# EAGLE schematic Server (EAGLE 7.3.0)
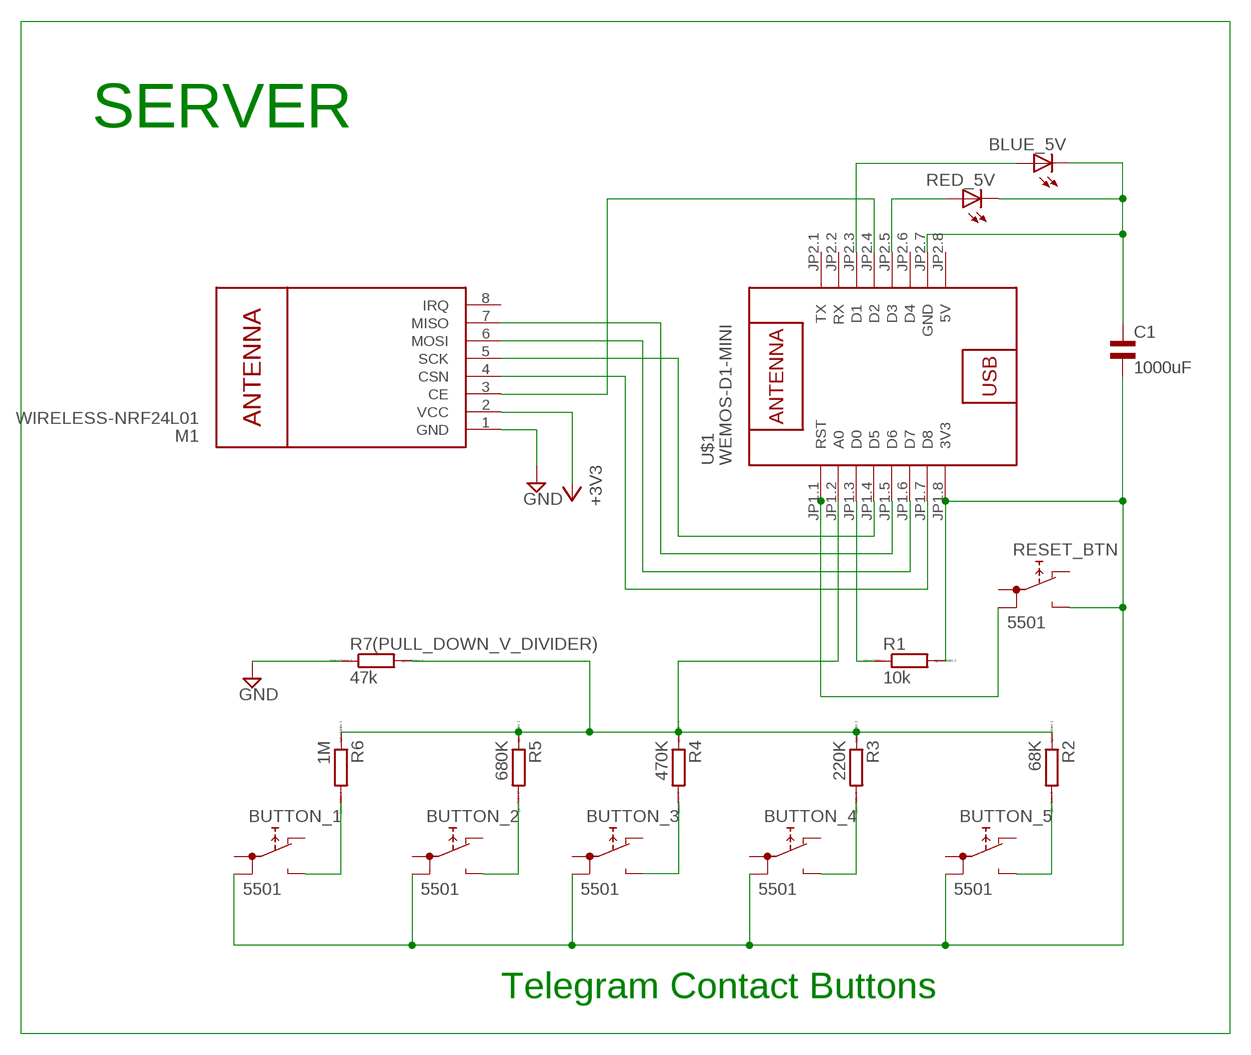
[diagram p0: schematic, sheet 1]

## Parts
BLUE_5V  LED5MM  [LED5MM]
BUTTON_1  5501  [5501]
BUTTON_2  5501  [5501]
BUTTON_3  5501  [5501]
BUTTON_4  5501  [5501]
BUTTON_5  5501  [5501]
C1  1000uF  EL-BI35-12AXIAL  [EU35-12]
M1  WIRELESS-NRF24L01  [WIRELESS-NRF24L01]
R1  10k  R0207/10  [0207/10]
R2  68K  R0207/10  [0207/10]
R3  220K  R0207/10  [0207/10]
R4  470K  R0207/10  [0207/10]
R5  680K  R0207/10  [0207/10]
R6  1M  R0207/10  [0207/10]
R7(PULL_DOWN_V_DIVIDER)  47k  R0207/10  [0207/10]
RED_5V  LED5MM  [LED5MM]
RESET_BTN  5501  [5501]
U$1  WEMOS-D1-MINI  [WEMOS-D1-MINI]

## Nets
+3V3: M1.2(VCC)
GND: M1.1(GND) R7(PULL_DOWN_V_DIVIDER).1
N$1: R2.1 R3.1 R4.1 R5.1 R6.1 R7(PULL_DOWN_V_DIVIDER).2 U$1.JP1.2(A0)
N$2: BUTTON_1.NO R6.2
N$3: BUTTON_2.NO R5.2
N$4: BUTTON_3.NO R4.2
N$5: BUTTON_4.NO R3.2
N$6: BUTTON_5.NO R2.2
N$7: M1.5(SCK) U$1.JP1.4(D5)
N$8: M1.7(MISO) U$1.JP1.5(D6)
N$9: R1.1 U$1.JP1.3(D0)
N$11: RESET_BTN.1B U$1.JP1.1(RST)
N$12: BUTTON_1.1B BUTTON_2.1B BUTTON_3.1B BUTTON_4.1B BUTTON_5.1B C1.2 R1.2 RESET_BTN.NO U$1.JP1.8(3V3)
N$13: M1.6(MOSI) U$1.JP1.6(D7)
N$14: M1.4(CSN) U$1.JP1.7(D8)
N$15: RED_5V.A U$1.JP2.5(D3)
N$16: BLUE_5V.A U$1.JP2.3(D1)
N$17: BLUE_5V.K(C) C1.1 RED_5V.K(C) U$1.JP2.7(GND)
N$18: M1.3(CE) U$1.JP2.4(D2)
Unconnected: BUTTON_1.1A BUTTON_1.NC BUTTON_2.1A BUTTON_2.NC BUTTON_3.1A BUTTON_3.NC BUTTON_4.1A BUTTON_4.NC BUTTON_5.1A BUTTON_5.NC M1.8(IRQ) RESET_BTN.1A RESET_BTN.NC U$1.JP2.1(TX) U$1.JP2.2(RX) U$1.JP2.6(D4)

## Notes on the sheet
- SERVER
- Telegram Contact Buttons

## Power pins joined to a net without a drawn wire
5V: U$1.JP2.8(5V)

## Library data of the parts
BLUE_5V RED_5V = led:LED: LED OSRAM: - CHIPLED LG R971, LG N971, LY N971, LG Q971, LY Q971, LO R971, LY R971 LH N974, LH R974 LS Q976, LO Q976, LY Q976 LO Q996 - Hyper CHIPLED LW Q18S LB Q993, LB Q99A, LB R99A - SideLED LS A670, LO A670, LY A670, LG A670, LP A670 LB A673, LV A673, LT A673, LW A673 LH A674 LY A675 LS A676, LA A676, LO A676, LY A676, LW A676 LS A679, LY A679, LG A679 - Hyper Micro SIDELED® LS Y876, LA Y876, LO Y876, LY Y876 LT Y87S - SmartLED LW L88C, LW L88S LB L89C, LB L89S, LG L890 LS L89K, LO L89K, LY L89K LS L896, LA L896, LO L896, LY L896 - TOPLED LS T670, LO T670, LY T670, LG T670, LP T670 LSG T670, LSP T670, LSY T670, LOP T670, LYG T670 LG T671, LOG T671, LSG T671 LB T673, LV T673, LT T673, LW T673 LH T674 LS T676, LA T676, LO T676, LY T676, LB T676, LH T676, LSB T676, LW T676 LB T67C, LV T67C, LT T67C, LS T67K, LO T67K, LY T67K, LW E67C LS E67B, LA E67B, LO E67B, LY E67B, LB E67C, LV E67C, LT E67C LW T67C LS T679, LY T679, LG T679 LS T770, LO T770, LY T770, LG T770, LP T770 LB T773, LV T773, LT T773, LW T773 LH T774 LS E675, LA E675, LY E675, LS T675 LS T776, LA T776, LO T776, LY T776, LB T776 LHGB T686 LT T68C, LB T68C - Hyper Mini TOPLED® LB M676 - Mini TOPLED Santana® LG M470 LS M47K, LO M47K, LY M47K Source: http://www.osram.convergy.de LUXEON: - LUMILED® LXK2-PW12-R00, LXK2-PW12-S00, LXK2-PW14-U00, LXK2-PW14-V00 LXK2-PM12-R00, LXK2-PM12-S00, LXK2-PM14-U00 LXK2-PE12-Q00, LXK2-PE12-R00, LXK2-PE12-S00, LXK2-PE14-T00, LXK2-PE14-U00 LXK2-PB12-K00, LXK2-PB12-L00, LXK2-PB12-M00, LXK2-PB14-N00, LXK2-PB14-P00, LXK2-PB14-Q00 LXK2-PR12-L00, LXK2-PR12-M00, LXK2-PR14-Q00, LXK2-PR14-R00 LXK2-PD12-Q00, LXK2-PD12-R00, LXK2-PD12-S00 LXK2-PH12-R00, LXK2-PH12-S00 LXK2-PL12-P00, LXK2-PL12-Q00, LXK2-PL12-R00 Source: www.luxeon.com KINGBRIGHT: KA-3528ASYC Source: www.kingbright.com
BUTTON_1-BUTTON_5 RESET_BTN = switch:55?: PUSHBUTTON SERIES 5500 SWITCHES Source: www.e-switch.com .. 5500.pdf
C1 = rcl:EL-: BIPOLAR ELECTROLYTIC CAPACITOR
M1 = diy-modules:WIRELESS-NRF24L01: 2.4 GHz Wireless Module based on NRF24L01 chip More details available here: http://www.electrodragon.com/w/NRF24L01 Click here to find device on ebay.com <http://www.ebay.com/sch/nrf24l01+arduino>
R1-R6 R7(PULL_DOWN_V_DIVIDER) = eagle-ltspice:R: RESISTOR, European symbol; SPICEMODEL: NONE; SPICEPREFIX: R
U$1 = diy-modules:WEMOS-D1-MINI: WEMOS D1 mini: Mini Wi-Fi Board based on ESP-8266 device More details can be found here: https://www.wemos.cc/product/d1-mini.html Click here to find device on ebay.com <http://www.ebay.com/sch/wemos+d1+mini+nodemcu>